# Altium schematic sheet 08.SchDoc
size 386 x 246 mm
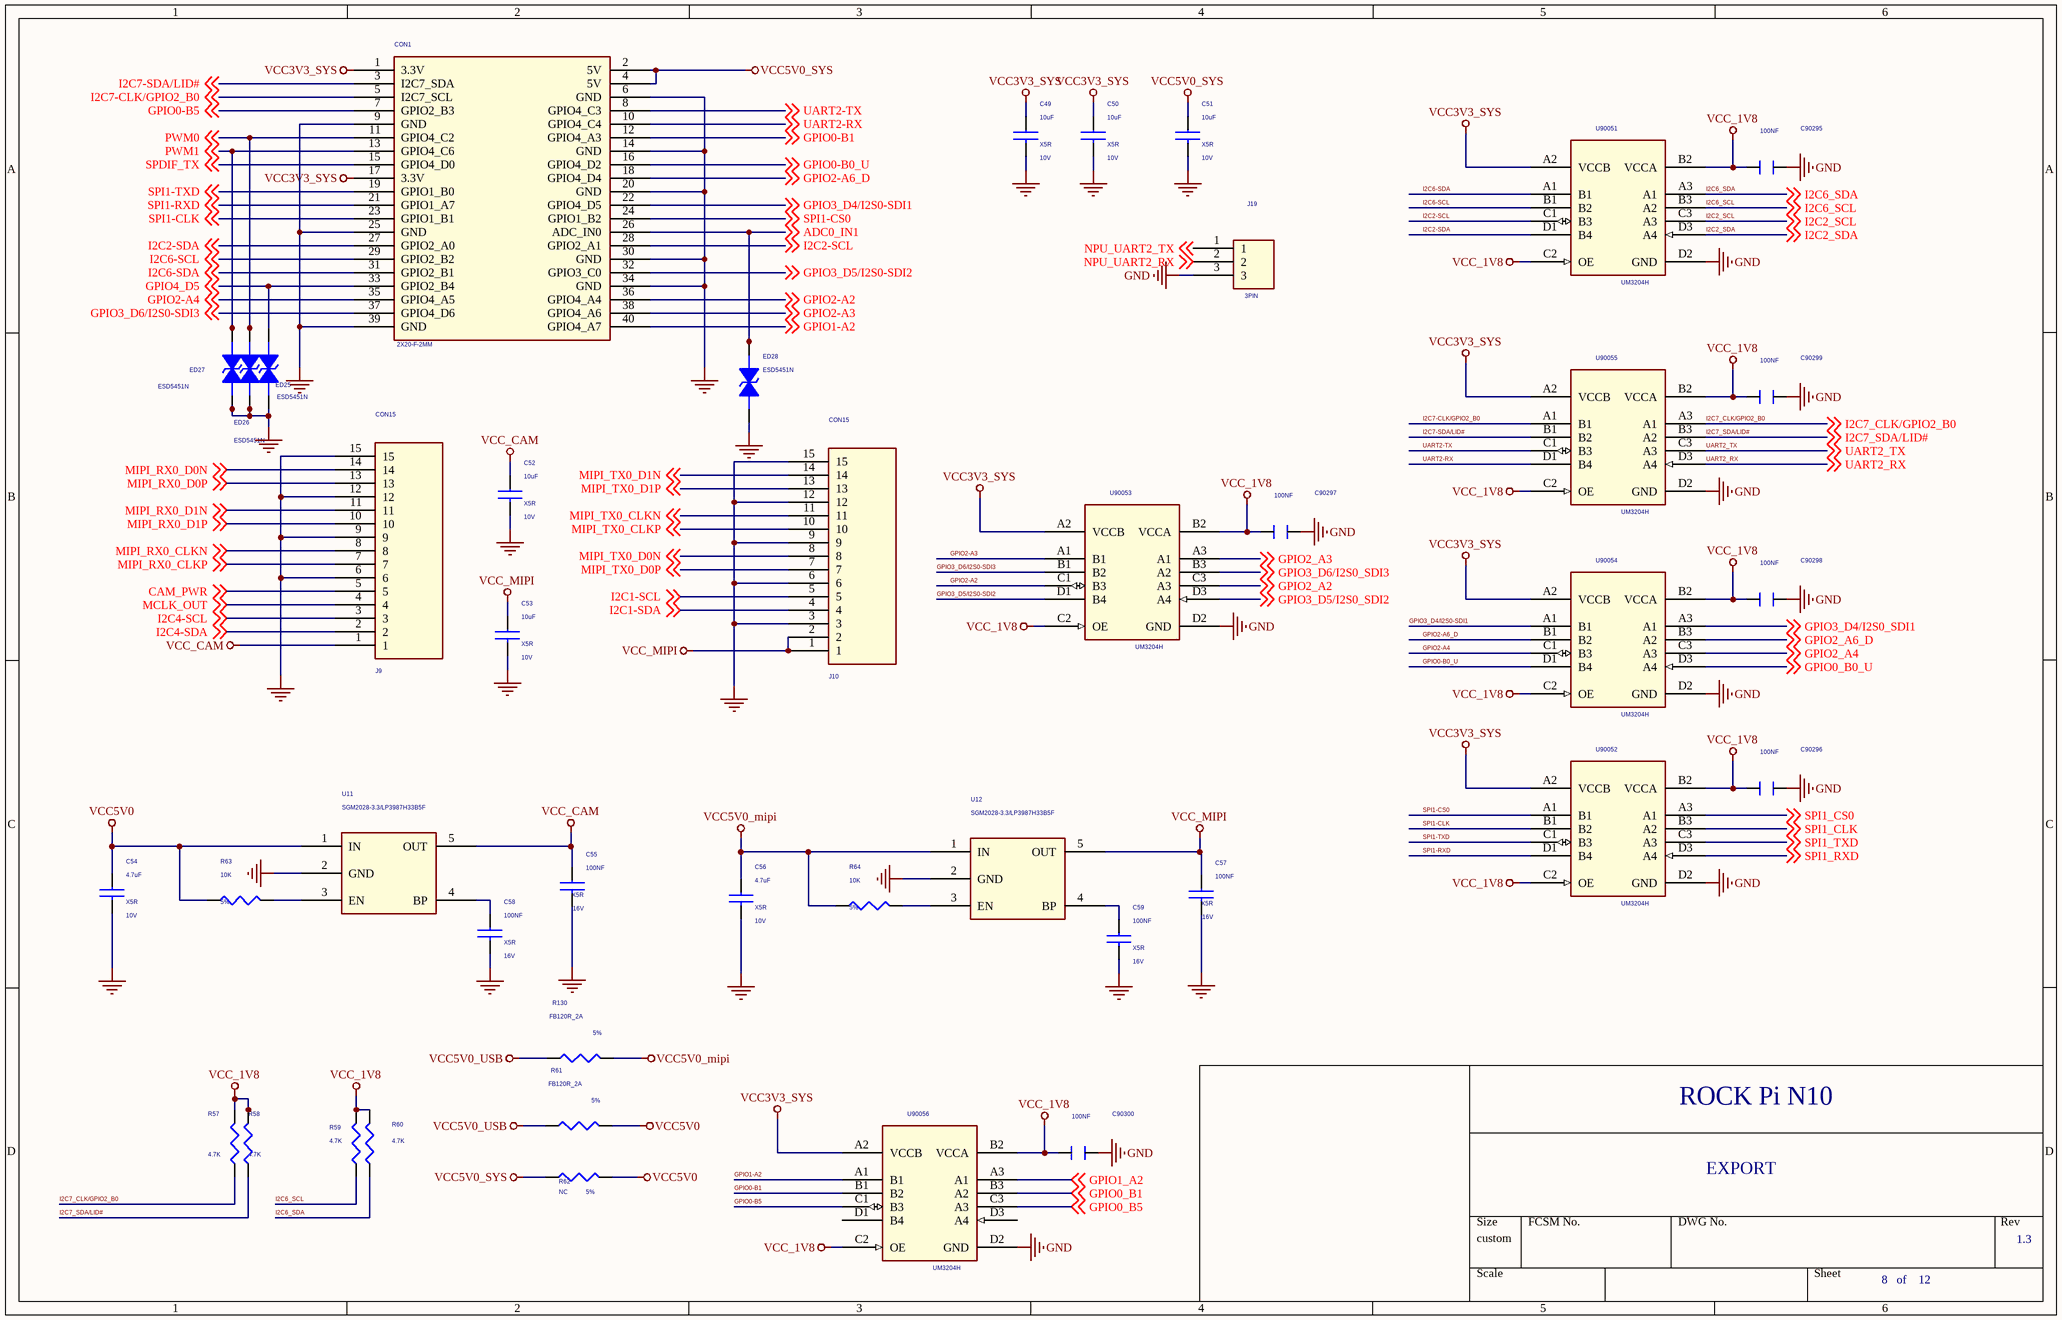
[diagram p0: 08.SchDoc]

## Parts
C49  10uF  Dielectric: X5R  Voltage: 10V  [C0603]
C50  10uF  Dielectric: X5R  Voltage: 10V  [C0603]
C51  10uF  Dielectric: X5R  Voltage: 10V  [C0603]
C52  10uF  Dielectric: X5R  Voltage: 10V  [C0603]
C53  10uF  Dielectric: X5R  Voltage: 10V  [C0603]
C54  4.7uF  Dielectric: X5R  Voltage: 10V  [C0603]
C55  100NF  Dielectric: X5R  Voltage: 16V  [C0402]
C56  4.7uF  Dielectric: X5R  Voltage: 10V  [C0603]
C57  100NF  Dielectric: X5R  Voltage: 16V  [C0402]
C58  100NF  Dielectric: X5R  Voltage: 16V  [C0402]
C59  100NF  Dielectric: X5R  Voltage: 16V  [C0402]
C90295  100NF  [C0402]
C90296  100NF  [C0402]
C90297  100NF  [C0402]
C90298  100NF  [C0402]
C90299  100NF  [C0402]
C90300  100NF  [C0402]
CON1  2X20-F-2MM  [DIP40PIN-2.54MM_FX]
ED25  ESD5451N  [ESD0402]
ED26  ESD5451N  [ESD0402]
ED27  ESD5451N  [ESD0402]
ED28  ESD5451N  [ESD0402]
J9  CON15  [FPC15PIN-1.0MM-LS]
J10  CON15  [FPC15PIN-1.0MM-LS]
J19  3PIN  [3PIN]
R57  4.7K  [R0402]
R58  4.7K  [R0402]
R59  4.7K  [R0402]
R60  4.7K  [R0402]
R61  FB120R_2A  Tolerance: 5%  [R0402]
R62  NC  Tolerance: 5%  [R0402]
R63  10K  Tolerance: 5%  [R0402]
R64  10K  Tolerance: 5%  [R0402]
R130  FB120R_2A  Tolerance: 5%  [R0402]
U11  SGM2028-3.3/LP3987H33B5F  [SOT_23_5]
U12  SGM2028-3.3/LP3987H33B5F  [SOT_23_5]
U90051  UM3204H  [CSP-12]
U90052  UM3204H  [CSP-12]
U90053  UM3204H  [CSP-12]
U90054  UM3204H  [CSP-12]
U90055  UM3204H  [CSP-12]
U90056  UM3204H  [CSP-12]

## Nets
GND: C49.2 C50.2 C51.2 C52.2 C53.2 C54.2 C55.2 C56.2 C57.2 C58.2 C59.2 C90295.1 C90296.1 C90297.1 C90298.1 C90299.1 C90300.1 CON1.6(GND) CON1.9(GND) CON1.14(GND) CON1.20(GND) CON1.25(GND) CON1.30(GND) CON1.34(GND) CON1.39(GND) ED25.2 ED26.2 ED27.2 ED28.2 J9.6 J9.9 J9.12 J9.15 J10.3 J10.6 J10.9 J10.12 J10.15 J19.3 U11.2(GND) U12.2(GND) U90051.D2(GND) U90052.D2(GND) U90053.D2(GND) U90054.D2(GND) U90055.D2(GND) U90056.D2(GND)
VCC3V3_SYS: C49.1 C50.1 CON1.1(3.3V) CON1.17(3.3V) U90051.A2(VCCB) U90052.A2(VCCB) U90053.A2(VCCB) U90054.A2(VCCB) U90055.A2(VCCB) U90056.A2(VCCB)
VCC5V0: C54.1 R61.2 R62.2 R63.1 U11.1(IN)
VCC5V0_mipi: C56.1 R64.1 R130.2 U12.1(IN)
VCC5V0_SYS: C51.1 CON1.2(5V) CON1.4(5V) R62.1
VCC5V0_USB: R61.1 R130.1
VCC_1V8: C90295.2 C90296.2 C90297.2 C90298.2 C90299.2 C90300.2 R57.2 R58.2 R59.2 R60.2 U90051.B2(VCCA) U90051.C2(OE) U90052.B2(VCCA) U90052.C2(OE) U90053.B2(VCCA) U90053.C2(OE) U90054.B2(VCCA) U90054.C2(OE) U90055.B2(VCCA) U90055.C2(OE) U90056.B2(VCCA) U90056.C2(OE)
VCC_CAM: C52.1 C55.1 J9.1 U11.5(OUT)
VCC_MIPI: C53.1 C57.1 J10.1 J10.2 U12.5(OUT)
ADC0_IN1: CON1.26(ADC_IN0) ED28.1 ; off-sheet ADC0_IN1
CAM_PWR: J9.5 ; off-sheet CAM_PWR
GPIO0-B0_U: CON1.16(GPIO4_D2) U90054.D1(B4) ; off-sheet GPIO0-B0_U
GPIO0-B1: CON1.12(GPIO4_A3) U90056.B1(B2) ; off-sheet GPIO0-B1
GPIO0-B5: CON1.7(GPIO2_B3) U90056.C1(B3) ; off-sheet GPIO0-B5
GPIO0_B0_U: U90054.D3(A4) ; off-sheet GPIO0_B0_U
GPIO0_B1: U90056.B3(A2) ; off-sheet GPIO0_B1
GPIO0_B5: U90056.C3(A3) ; off-sheet GPIO0_B5
GPIO1-A2: CON1.40(GPIO4_A7) U90056.A1(B1) ; off-sheet GPIO1-A2
GPIO1_A2: U90056.A3(A1) ; off-sheet GPIO1_A2
GPIO2-A2: CON1.36(GPIO4_A4) U90053.C1(B3) ; off-sheet GPIO2-A2
GPIO2-A3: CON1.38(GPIO4_A6) U90053.A1(B1) ; off-sheet GPIO2-A3
GPIO2-A4: CON1.35(GPIO4_A5) U90054.C1(B3) ; off-sheet GPIO2-A4
GPIO2-A6_D: CON1.18(GPIO4_D4) U90054.B1(B2) ; off-sheet GPIO2-A6_D
GPIO2_A2: U90053.C3(A3) ; off-sheet GPIO2_A2
GPIO2_A3: U90053.A3(A1) ; off-sheet GPIO2_A3
GPIO2_A4: U90054.C3(A3) ; off-sheet GPIO2_A4
GPIO2_A6_D: U90054.B3(A2) ; off-sheet GPIO2_A6_D
GPIO3_D4/I2S0-SDI1: CON1.22(GPIO4_D5) U90054.A1(B1) ; off-sheet GPIO3_D4/I2S0-SDI1
GPIO3_D4/I2S0_SDI1: U90054.A3(A1) ; off-sheet GPIO3_D4/I2S0_SDI1
GPIO3_D5/I2S0-SDI2: CON1.32(GPIO3_C0) U90053.D1(B4) ; off-sheet GPIO3_D5/I2S0-SDI2
GPIO3_D5/I2S0_SDI2: U90053.D3(A4) ; off-sheet GPIO3_D5/I2S0_SDI2
GPIO3_D6/I2S0-SDI3: CON1.37(GPIO4_D6) U90053.B1(B2) ; off-sheet GPIO3_D6/I2S0-SDI3
GPIO3_D6/I2S0_SDI3: U90053.B3(A2) ; off-sheet GPIO3_D6/I2S0_SDI3
GPIO4_D5: CON1.33(GPIO2_B4) ED25.1 ; off-sheet GPIO4_D5
I2C1-SCL: J10.5 ; off-sheet I2C1-SCL
I2C1-SDA: J10.4 ; off-sheet I2C1-SDA
I2C2-SCL: CON1.28(GPIO2_A1) U90051.C1(B3) ; off-sheet I2C2-SCL
I2C2-SDA: CON1.27(GPIO2_A0) U90051.D1(B4) ; off-sheet I2C2-SDA
I2C2_SCL: U90051.C3(A3) ; off-sheet I2C2_SCL
I2C2_SDA: U90051.D3(A4) ; off-sheet I2C2_SDA
I2C4-SCL: J9.3 ; off-sheet I2C4-SCL
I2C4-SDA: J9.2 ; off-sheet I2C4-SDA
I2C6-SCL: CON1.29(GPIO2_B2) U90051.B1(B2) ; off-sheet I2C6-SCL
I2C6-SDA: CON1.31(GPIO2_B1) U90051.A1(B1) ; off-sheet I2C6-SDA
I2C6_SCL: R59.1 U90051.B3(A2) ; off-sheet I2C6_SCL
I2C6_SDA: R60.1 U90051.A3(A1) ; off-sheet I2C6_SDA
I2C7-CLK/GPIO2_B0: CON1.5(I2C7_SCL) U90055.A1(B1) ; off-sheet I2C7-CLK/GPIO2_B0
I2C7-SDA/LID#: CON1.3(I2C7_SDA) U90055.B1(B2) ; off-sheet I2C7-SDA/LID#
I2C7_CLK/GPIO2_B0: R57.1 U90055.A3(A1) ; off-sheet I2C7_CLK/GPIO2_B0
I2C7_SDA/LID#: R58.1 U90055.B3(A2) ; off-sheet I2C7_SDA/LID#
MCLK_OUT: J9.4 ; off-sheet MCLK_OUT
MIPI_RX0_CLKN: J9.8 ; off-sheet MIPI_RX0_CLKN
MIPI_RX0_CLKP: J9.7 ; off-sheet MIPI_RX0_CLKP
MIPI_RX0_D0N: J9.14 ; off-sheet MIPI_RX0_D0N
MIPI_RX0_D0P: J9.13 ; off-sheet MIPI_RX0_D0P
MIPI_RX0_D1N: J9.11 ; off-sheet MIPI_RX0_D1N
MIPI_RX0_D1P: J9.10 ; off-sheet MIPI_RX0_D1P
MIPI_TX0_CLKN: J10.11 ; off-sheet MIPI_TX0_CLKN
MIPI_TX0_CLKP: J10.10 ; off-sheet MIPI_TX0_CLKP
MIPI_TX0_D0N: J10.8 ; off-sheet MIPI_TX0_D0N
MIPI_TX0_D0P: J10.7 ; off-sheet MIPI_TX0_D0P
MIPI_TX0_D1N: J10.14 ; off-sheet MIPI_TX0_D1N
MIPI_TX0_D1P: J10.13 ; off-sheet MIPI_TX0_D1P
NPU_UART2_RX: J19.2 ; off-sheet NPU_UART2_RX
NPU_UART2_TX: J19.1 ; off-sheet NPU_UART2_TX
PWM0: CON1.11(GPIO4_C2) ED26.1 ; off-sheet PWM0
PWM1: CON1.13(GPIO4_C6) ED27.1 ; off-sheet PWM1
SPDIF_TX: CON1.15(GPIO4_D0) ; off-sheet SPDIF_TX
SPI1-CLK: CON1.23(GPIO1_B1) U90052.B1(B2) ; off-sheet SPI1-CLK
SPI1-CS0: CON1.24(GPIO1_B2) U90052.A1(B1) ; off-sheet SPI1-CS0
SPI1-RXD: CON1.21(GPIO1_A7) U90052.D1(B4) ; off-sheet SPI1-RXD
SPI1-TXD: CON1.19(GPIO1_B0) U90052.C1(B3) ; off-sheet SPI1-TXD
SPI1_CLK: U90052.B3(A2) ; off-sheet SPI1_CLK
SPI1_CS0: U90052.A3(A1) ; off-sheet SPI1_CS0
SPI1_RXD: U90052.D3(A4) ; off-sheet SPI1_RXD
SPI1_TXD: U90052.C3(A3) ; off-sheet SPI1_TXD
UART2-RX: CON1.10(GPIO4_C4) U90055.D1(B4) ; off-sheet UART2-RX
UART2-TX: CON1.8(GPIO4_C3) U90055.C1(B3) ; off-sheet UART2-TX
UART2_RX: U90055.D3(A4) ; off-sheet UART2_RX
UART2_TX: U90055.C3(A3) ; off-sheet UART2_TX
NetC58_1: C58.1 U11.4(BP)
NetC59_1: C59.1 U12.4(BP)
NetR63_2: R63.2 U11.3(EN)
NetR64_2: R64.2 U12.3(EN)

Not connected (* = marked no-connect by the designer): U90056 D1(B4) D3(A4)

## Notes on the sheet
- ROCK Pi N10
- EXPORT
- 1.3
- 8   of    12

## Library data of the parts
C49 C52 = CAP NP_2: cap,10.00uF,+/-10%,10V,X5R,C0805; Manufacturer PN: C2012X5R1A106K125AB; Manufacturer: TDK; Tolerance: 10%; Priority: A; Created by: JJJ; Part Type: C0805; RK PN: C2012X5R1A106K125AB
C50 C51 C53 = CAP NP_2: cap,10.00uF,+/-10%,10V,X5R,C0805; Manufacturer: TDK; RK PN: C2012X5R1A106K125AB; Priority: A; Tolerance: 10%; Part Type: C0805; Manufacturer PN: C2012X5R1A106K125AB; Created by: JJJ
C54 C56 = CAP NP_2: cap,4.70uF,+/-10%,10V,X5R,C0603; Manufacturer: TDK; RK PN: C1608X5R1A475K080AC; Priority: A; Tolerance: 10%; Part Type: C0603; Manufacturer PN: C1608X5R1A475K080AC; Created by: JJJ
C55 C58 C59 = CAP NP_2: cap,100.00nF,+/-10%,16V,X5R,C0402; Manufacturer: TDK; RK PN: C1005X5R1C104K050BA; Priority: A; Tolerance: 10%; Part Type: C0402; Manufacturer PN: C1005X5R1C104K050BA; Created by: JJJ
C57 = CAP NP_2: cap,100.00nF,+/-10%,16V,X5R,C0402; Manufacturer PN: C1005X5R1C104K050BA; Manufacturer: TDK; Tolerance: 10%; Priority: A; Created by: JJJ; Part Type: C0402; RK PN: C1005X5R1C104K050BA
C90295-C90300 = CAPACITOR_0: PAGE: 1
CON1 = CN_4
ED25-ED28 = DIODE BI_DIR TRIG_0: 1-Line, Bi-directional, Transient Voltage Suppressors.17.5pF.; Manufacturer: WillSemi(韦尔半导体); Priority: A; RK PN: ESD5451N; Part Type: ESD_TVS; Manufacturer PN: ESD5451N; Created by: JJJ
J9 J10 = CON15_0
R57-R60 = R_2
R61 R63 R64 = RESISTOR_3: 通用厚膜电阻,10K,+/-5%,R0402,1/16W.; Manufacturer PN: RC0402JR-0710KL; Manufacturer: YAGEO; Wattage: 1/16W; Priority: A; Created by: YTL; RK PN: RC0402JR-0710KL
  R61: Part Type: R0603
  R63 R64: Part Type: 通用厚膜电阻
R62 R130 = RESISTOR_3: 通用厚膜电阻,10K,+/-5%,R0402,1/16W.; Manufacturer: YAGEO; RK PN: RC0402JR-0710KL; Priority: A; Wattage: 1/16W; Part Type: R0603; Manufacturer PN: RC0402JR-0710KL; Created by: YTL
U11 U12 = LDO_PT5108: 500mA, Low Dropout, Low Noise Ultra-Fast Without Bypass Capacitor CMOS LDO Regulator; Manufacturer PN: RT9013-30GB; Manufacturer: Richtek（立錡）; Priority: A; RK PN: RT9013-30B; Option: /CE75B30M; Created by: JJJ; Part Type: LDO
U90051 U90055 = MP2610_0: 4-bit Bi-directional Level Shifter UM3204H; Part Number: PI4ULS5V104GAEX; Vendor: PERICOM
U90052 U90053 U90056 = MP2610_0: 4-bit Bi-directional Level Shifter  UM3204H; Part Number: PI4ULS5V104GAEX; Vendor: PERICOM
U90054 = MP2610_0: 4-bit Bi-directional Level Shifter   UM3204H; Part Number: PI4ULS5V104GAEX; Vendor: PERICOM